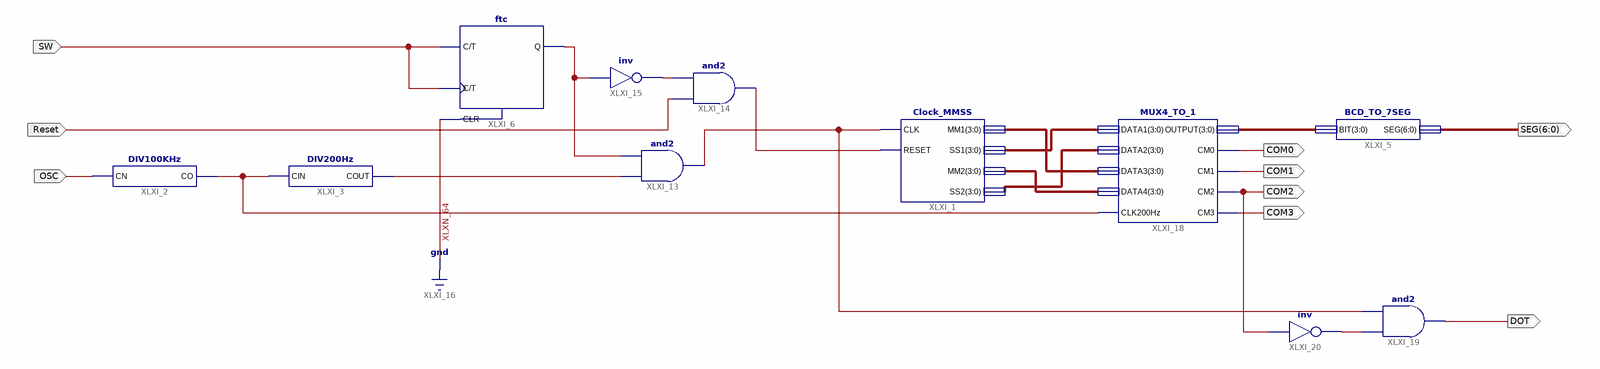
[diagram p0: schematic sheet 1]
// Xilinx ISE schematic ALU.sch (spartan6) as structural Verilog: 11 symbols, 9 ports
module ALU (
  input  Reset,
  input  SW,
  input  OSC,
  output COM0,
  output COM1,
  output COM2,
  output COM3,
  output [6:0] SEG,
  output DOT
);

  wire HZ, XLXN_52, XLXN_53, XLXN_58, XLXN_68, XLXN_74, XLXN_75;
  wire [3:0] XLXN_7, XLXN_8, XLXN_9, XLXN_10, XLXN_17;

  Clock_MMSS XLXI_1 (.CLK(XLXN_74), .MM1(XLXN_9), .MM2(XLXN_10), .RESET(XLXN_58), .SS1(XLXN_7), .SS2(XLXN_8));
  BCD_TO_7SEG XLXI_5 (.BIT(XLXN_17), .SEG(SEG));
  DIV100KHz XLXI_2 (.CN(OSC), .CO(HZ));
  DIV200Hz XLXI_3 (.CIN(HZ), .COUT(XLXN_68));
  ftc XLXI_6 (.C(SW), .CLR(1'b0), .T(SW), .Q(XLXN_53));
  and XLXI_13 (XLXN_74, XLXN_68, XLXN_53);
  and XLXI_14 (XLXN_58, Reset, XLXN_52);
  not XLXI_15 (XLXN_52, XLXN_53);
  MUX4_TO_1 XLXI_18 (
    .CLK200Hz(HZ), .CM0(COM0), .CM1(COM1), .CM2(COM2), .CM3(COM3), .DATA1(XLXN_7), .DATA2(XLXN_8),
    .DATA3(XLXN_9), .DATA4(XLXN_10), .OUTPUT(XLXN_17));
  and XLXI_19 (DOT, XLXN_75, XLXN_74);
  not XLXI_20 (XLXN_75, COM2);
endmodule
